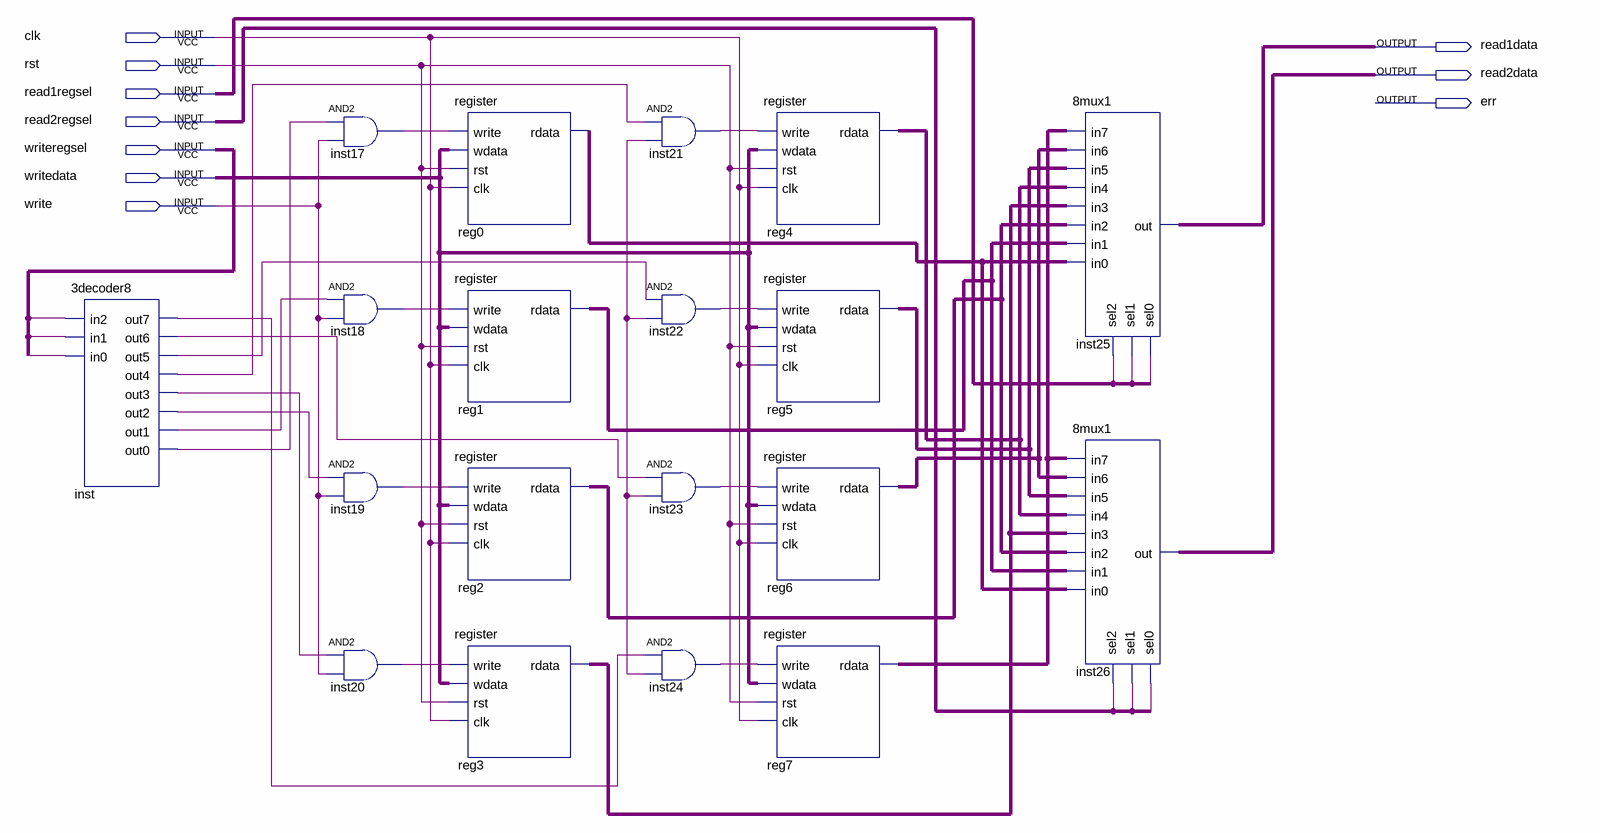
[diagram p0: schematic sheet]
// Quartus schematic rf.bdf as structural Verilog: 19 symbols, 10 pins
module rf (
  input  clk,
  input  rst,
  input  read1regsel,
  input  read2regsel,
  input  writeregsel,
  input  writedata,
  input  write,
  output read1data,
  output read2data,
  output err
);

  wire inst17_out, inst18_out, inst19_out, inst20_out, inst21_out, inst22_out, inst23_out, inst24_out,
       inst_out0, inst_out1, inst_out2, inst_out3, inst_out4, inst_out5, inst_out6, inst_out7, reg0_rdata,
       reg1_rdata, reg2_rdata, reg3_rdata, reg4_rdata, reg5_rdata, reg6_rdata, reg7_rdata, undriven;

  \3decoder8  inst (
    .in2(writeregsel), .in1(writeregsel), .in0(writeregsel), .out7(inst_out7), .out6(inst_out6),
    .out5(inst_out5), .out4(inst_out4), .out3(inst_out3), .out2(inst_out2), .out1(inst_out1), .out0(inst_out0));
  and inst17 (inst17_out, inst_out0, write);
  and inst18 (inst18_out, inst_out1, write);
  and inst19 (inst19_out, inst_out2, write);
  and inst20 (inst20_out, inst_out3, write);
  register reg0 (.write(inst17_out), .wdata(writedata), .rst(rst), .clk(clk), .rdata(reg0_rdata));
  register reg1 (.write(inst18_out), .wdata(writedata), .rst(rst), .clk(clk), .rdata(reg1_rdata));
  register reg2 (.write(inst19_out), .wdata(writedata), .rst(rst), .clk(clk), .rdata(reg2_rdata));
  register reg3 (.write(inst20_out), .wdata(writedata), .rst(rst), .clk(clk), .rdata(reg3_rdata));
  and inst21 (inst21_out, inst_out4, undriven);
  and inst22 (inst22_out, inst_out5, undriven);
  and inst23 (inst23_out, inst_out6, undriven);
  and inst24 (inst24_out, inst_out7, undriven);
  register reg4 (.write(inst21_out), .wdata(writedata), .rst(rst), .clk(clk), .rdata(reg4_rdata));
  register reg5 (.write(inst22_out), .wdata(writedata), .rst(rst), .clk(clk), .rdata(reg5_rdata));
  register reg6 (.write(inst23_out), .wdata(writedata), .rst(rst), .clk(clk), .rdata(reg6_rdata));
  register reg7 (.write(inst24_out), .wdata(writedata), .rst(rst), .clk(clk), .rdata(reg7_rdata));
  \8mux1  inst25 (
    .sel2(read1regsel), .sel1(read1regsel), .sel0(read1regsel), .in7(reg7_rdata), .in6(reg6_rdata),
    .in5(reg5_rdata), .in4(reg4_rdata), .in3(reg3_rdata), .in2(reg2_rdata), .in1(reg1_rdata),
    .in0(reg0_rdata), .out(read1data));
  \8mux1  inst26 (
    .sel2(read2regsel), .sel1(read2regsel), .sel0(read2regsel), .in7(reg7_rdata), .in6(reg6_rdata),
    .in5(reg5_rdata), .in4(reg4_rdata), .in3(reg3_rdata), .in2(reg2_rdata), .in1(reg1_rdata),
    .in0(reg0_rdata), .out(read2data));
endmodule
